# Altium schematic sheet lp5012.SchDoc
size A
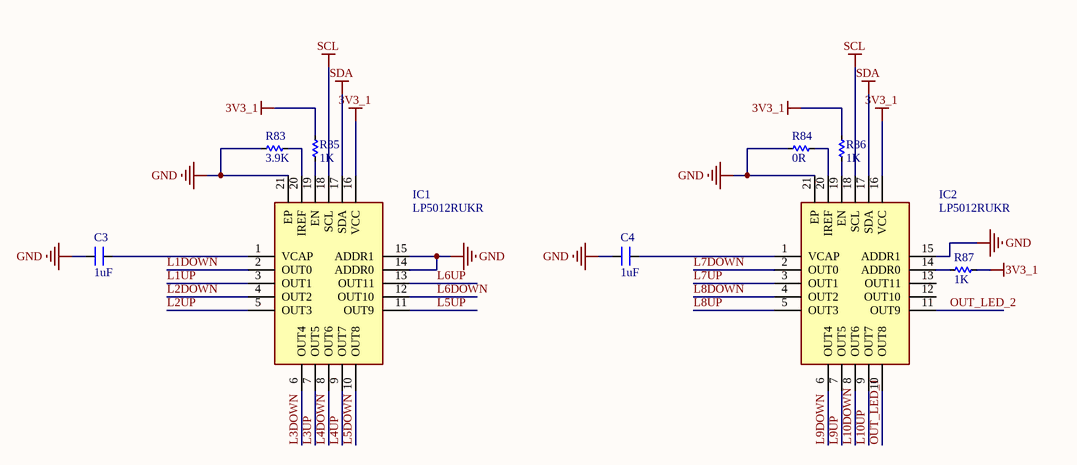
[diagram p0: lp5012.SchDoc]

## Parts
C3  1uF  [CN-SMD-0603]
C4  1uF  [CN-SMD-0603]
IC1  LP5012RUKR  [QFN40P300X300X80-21N-D]
IC2  LP5012RUKR  [QFN40P300X300X80-21N-D]
R83  3.9K  [RES-SMD-0603]
R84  0R  [RES-SMD-0603]
R85  1K  [RES-SMD-0603]
R86  1K  [RES-SMD-0603]
R87  1K  [RES-SMD-0603]

## Nets
3V3_1: IC1.16(VCC) IC2.16(VCC) R85.1 R86.1 R87.2
GND: C3.1 C4.1 IC1.14(ADDR0) IC1.15(ADDR1) IC1.21(EP) IC2.15(ADDR1) IC2.21(EP) R83.2 R84.2
SCL: IC1.18(SCL) IC2.18(SCL)
SDA: IC1.17(SDA) IC2.17(SDA)
L1DOWN: IC1.2(OUT0)
L1UP: IC1.3(OUT1)
L2DOWN: IC1.4(OUT2)
L2UP: IC1.5(OUT3)
L3DOWN: IC1.6(OUT4)
L3UP: IC1.7(OUT5)
L4DOWN: IC1.8(OUT6)
L4UP: IC1.9(OUT7)
L5DOWN: IC1.10(OUT8)
L5UP: IC1.11(OUT9)
L6DOWN: IC1.12(OUT10)
L6UP: IC1.13(OUT11)
L7DOWN: IC2.2(OUT0)
L7UP: IC2.3(OUT1)
L8DOWN: IC2.4(OUT2)
L8UP: IC2.5(OUT3)
L9DOWN: IC2.6(OUT4)
L9UP: IC2.7(OUT5)
L10DOWN: IC2.8(OUT6)
L10UP: IC2.9(OUT7)
OUT_LED_1: IC2.10(OUT8)
OUT_LED_2: IC2.11(OUT9)
NetC3_2: C3.2 IC1.1(VCAP)
NetC4_2: C4.2 IC2.1(VCAP)
NetIC1_19: IC1.19(EN) R85.2
NetIC1_20: IC1.20(IREF) R83.1
NetIC2_14: IC2.14(ADDR0) R87.1
NetIC2_19: IC2.19(EN) R86.2
NetIC2_20: IC2.20(IREF) R84.1

Not connected (* = marked no-connect by the designer): IC2 12(OUT10) 13(OUT11)

## Library data of the parts
C3 C4 = CN: Value: 33pF
IC1 IC2 = LP5012RUKR: Integrated Circuit; Manufacturer_Name: Texas Instruments; Datasheet Link: http://www.ti.com/lit/gpn/LP5012; Height: 0.8mm; Manufacturer_Part_Number: LP5012RUKR; Mouser Part Number: 595-LP5012RUKR; Mouser Price/Stock: https://www.mouser.co.uk/ProductDetail/Texas-Instruments/LP5012RUKR?qs=mAH9sUMRCts7Z0PlkfxWfA%3D%3D; Arrow Part Number: LP5012RUKR; Arrow Price/Stock: https://www.arrow.com/en/products/lp5012rukr/texas-instruments?region=nac
R83-R87 = Res-SMD: Resistor; Manufacturer: Generic Components; Class: Passive; Published: 08/06/2000; Publisher: Altium Hobart Technology Centre